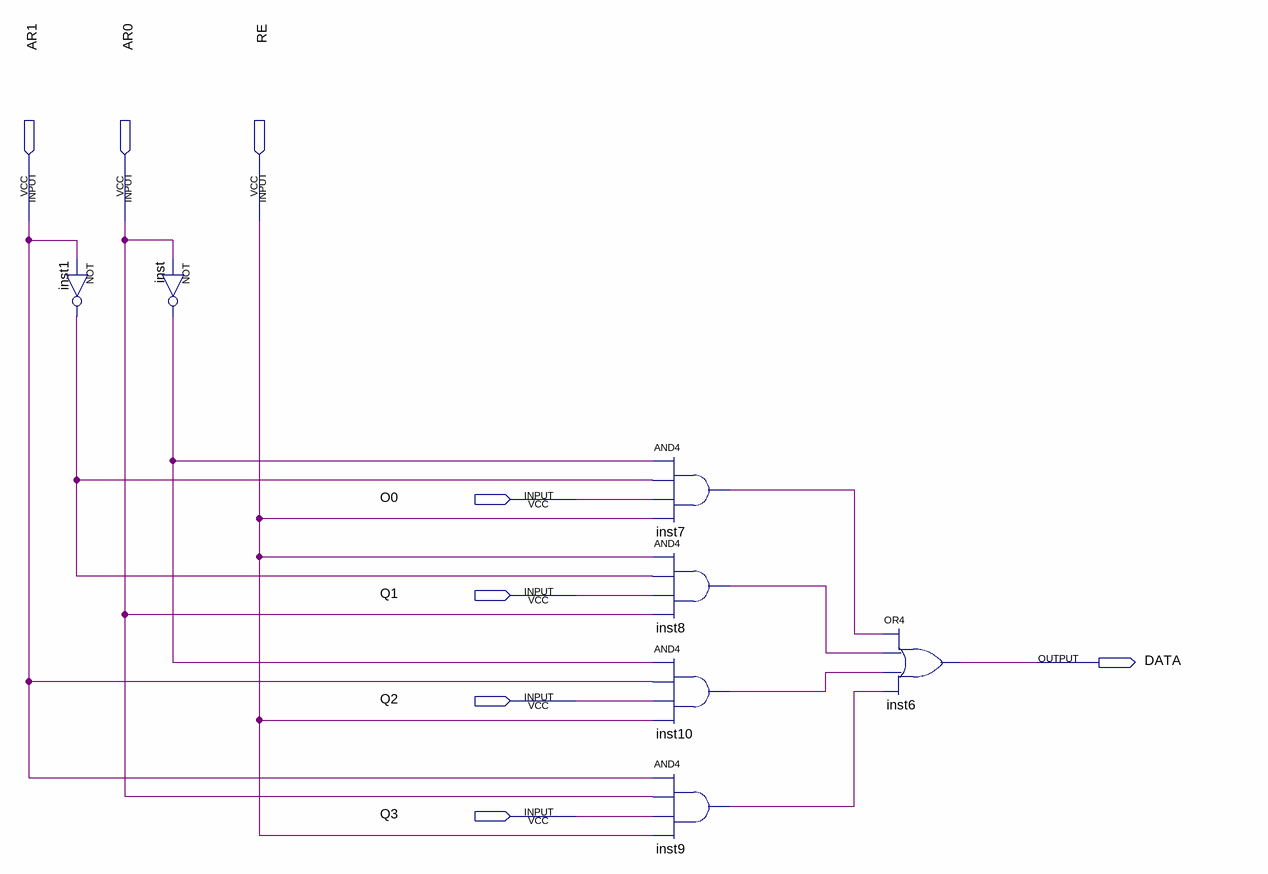
[diagram p0: schematic sheet]
// Quartus schematic MUX4bit.bdf as structural Verilog: 7 symbols, 8 pins
module MUX4bit (
  input  AR1,
  input  AR0,
  input  RE,
  input  O0,
  input  Q1,
  input  Q2,
  input  Q3,
  output DATA
);

  wire inst1_out, inst7_out, inst8_out, inst9_out, inst10_out, inst_out;

  not inst1 (inst1_out, AR1);
  not inst (inst_out, AR0);
  and inst7 (inst7_out, inst_out, inst1_out, O0, RE);
  and inst8 (inst8_out, RE, inst1_out, Q1, AR0);
  and inst10 (inst10_out, inst_out, AR1, Q2, RE);
  and inst9 (inst9_out, AR1, AR0, Q3, RE);
  or inst6 (DATA, inst7_out, inst8_out, inst10_out, inst9_out);
endmodule
